# EAGLE design untitled (EAGLE 7.7.0)
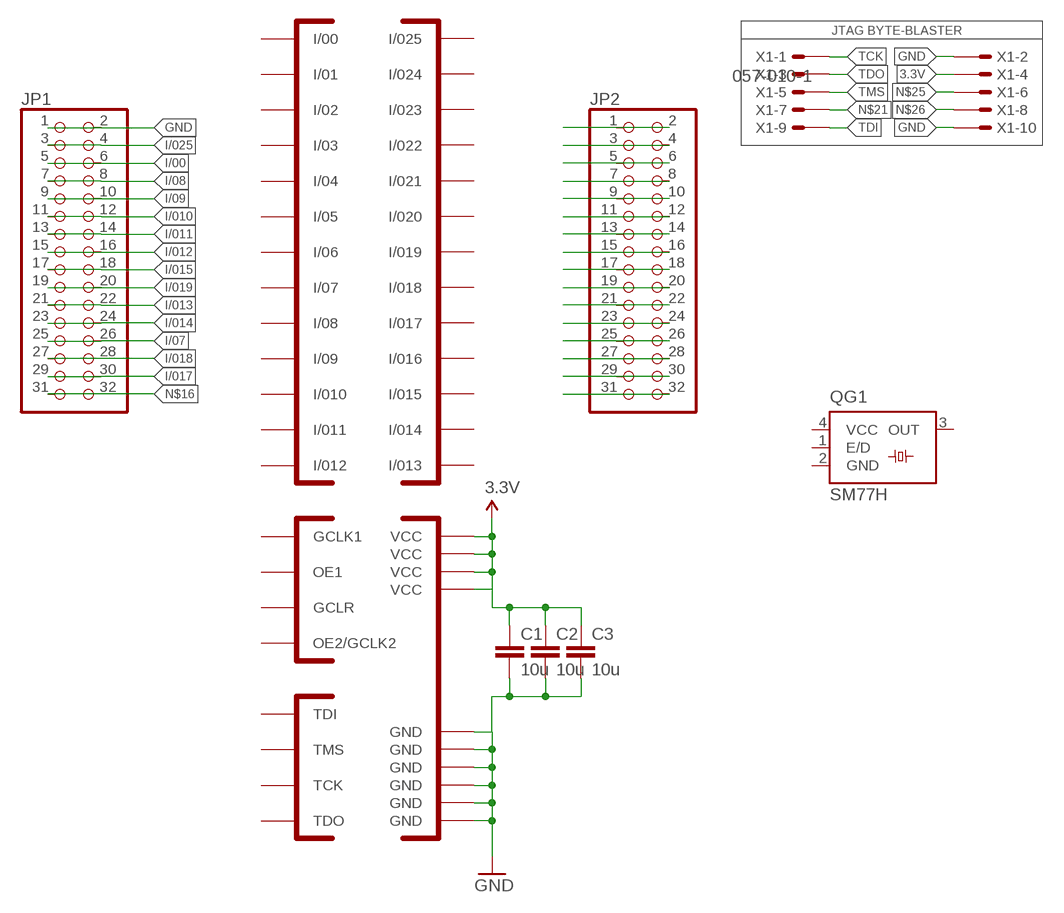
[diagram p0: schematic, sheet 1]

## Parts
C1  10u  CAP0805  [0805]
C2  10u  CAP0805  [0805]
C3  10u  CAP0805  [0805]
JP1  PINHD-2X16_2.54-SMD  [2X16SMD]
JP2  PINHD-2X16_2.54-SMD  [2X16SMD]
QG1  SM77H  [SM77H]
U$1  EPM3032  [TQFP44]
X1  057-010-1  [057-010-1]

## Nets
3.3V: C1.1 C2.1 C3.1 U$1.9(VCC) U$1.17(VCC) U$1.29(VCC) U$1.41(VCC) X1.4
GND: C1.2 C2.2 C3.2 JP1.1 JP1.2 U$1.4(GND) U$1.11(GND) U$1.16(GND) U$1.24(GND) U$1.30(GND) U$1.36(GND) X1.2 X1.10
I/00: JP1.5 JP1.6
I/07: JP1.25 JP1.26
I/08: JP1.7 JP1.8
I/09: JP1.9 JP1.10
I/010: JP1.11 JP1.12
I/011: JP1.13 JP1.14
I/012: JP1.15 JP1.16
I/013: JP1.21 JP1.22
I/014: JP1.23 JP1.24
I/015: JP1.17 JP1.18
I/017: JP1.29 JP1.30
I/018: JP1.27 JP1.28
I/019: JP1.19 JP1.20
I/025: JP1.3 JP1.4
N$1: JP2.7 JP2.8
N$2: JP2.27 JP2.28
N$3: JP2.31 JP2.32
N$4: JP2.23 JP2.24
N$5: JP2.19 JP2.20
N$6: JP2.15 JP2.16
N$7: JP2.1 JP2.2
N$8: JP2.3 JP2.4
N$9: JP2.11 JP2.12
N$10: JP2.5 JP2.6
N$11: JP2.9 JP2.10
N$12: JP2.13 JP2.14
N$13: JP2.17 JP2.18
N$14: JP2.21 JP2.22
N$15: JP2.25 JP2.26
N$16: JP1.31 JP1.32
N$17: JP2.29 JP2.30
N$21: X1.7
N$25: X1.6
N$26: X1.8
TCK: X1.1
TDI: X1.9
TDO: X1.3
TMS: X1.5
Unconnected: QG1.1(E/D) QG1.3(OUT)

## Notes on the sheet
- JTAG BYTE-BLASTER

## Power pins joined to a net without a drawn wire
GCLK1: U$1.37(GCLK1)
GCLR: U$1.39(GCLR)
GND: QG1.2(GND)
I/00: U$1.2(I/00)
I/01: U$1.5(I/01)
I/02: U$1.6(I/02)
I/03: U$1.12(I/03)
I/04: U$1.13(I/04)
I/05: U$1.14(I/05)
I/06: U$1.15(I/06)
I/07: U$1.25(I/07)
I/08: U$1.44(I/08)
I/09: U$1.43(I/09)
I/010: U$1.42(I/010)
I/011: U$1.35(I/011)
I/012: U$1.34(I/012)
I/013: U$1.28(I/013)
I/014: U$1.27(I/014)
I/015: U$1.33(I/015)
I/016: U$1.21(I/016)
I/017: U$1.22(I/017)
I/018: U$1.23(I/018)
I/019: U$1.31(I/019)
I/020: U$1.18(I/020)
I/021: U$1.19(I/021)
I/022: U$1.8(I/022)
I/023: U$1.20(I/023)
I/024: U$1.10(I/024)
I/025: U$1.3(I/025)
OE1: U$1.38(OE1)
OE2/GCLK2: U$1.40(OE2/GCLK2)
TCK: U$1.26(TCK)
TDI: U$1.1(TDI)
TDO: U$1.32(TDO)
TMS: U$1.7(TMS)
VCC: QG1.4(VCC)

## Library data of the parts
C1-C3 = SparkFun-Passives:CAP: Capacitor Standard 0603 ceramic capacitor, and 0.1" leaded capacitor.
JP1 JP2 = pinhead-2:PINHD-2X16: PIN HEADER
QG1 = crystal:SM77H: 3.3V CMOS Clock Oscillator Source: www.pletronics.com .. sm77h%203.3v.pdf; OC_FARNELL: unknown; OC_NEWARK: unknown
U$1 = EPM3032:EPM3032
X1 = con-panduit:057-010-: CONNECTOR 10-pin series 057 contact pc board low profile headers; OC_FARNELL: unknown; OC_NEWARK: unknown

## Board
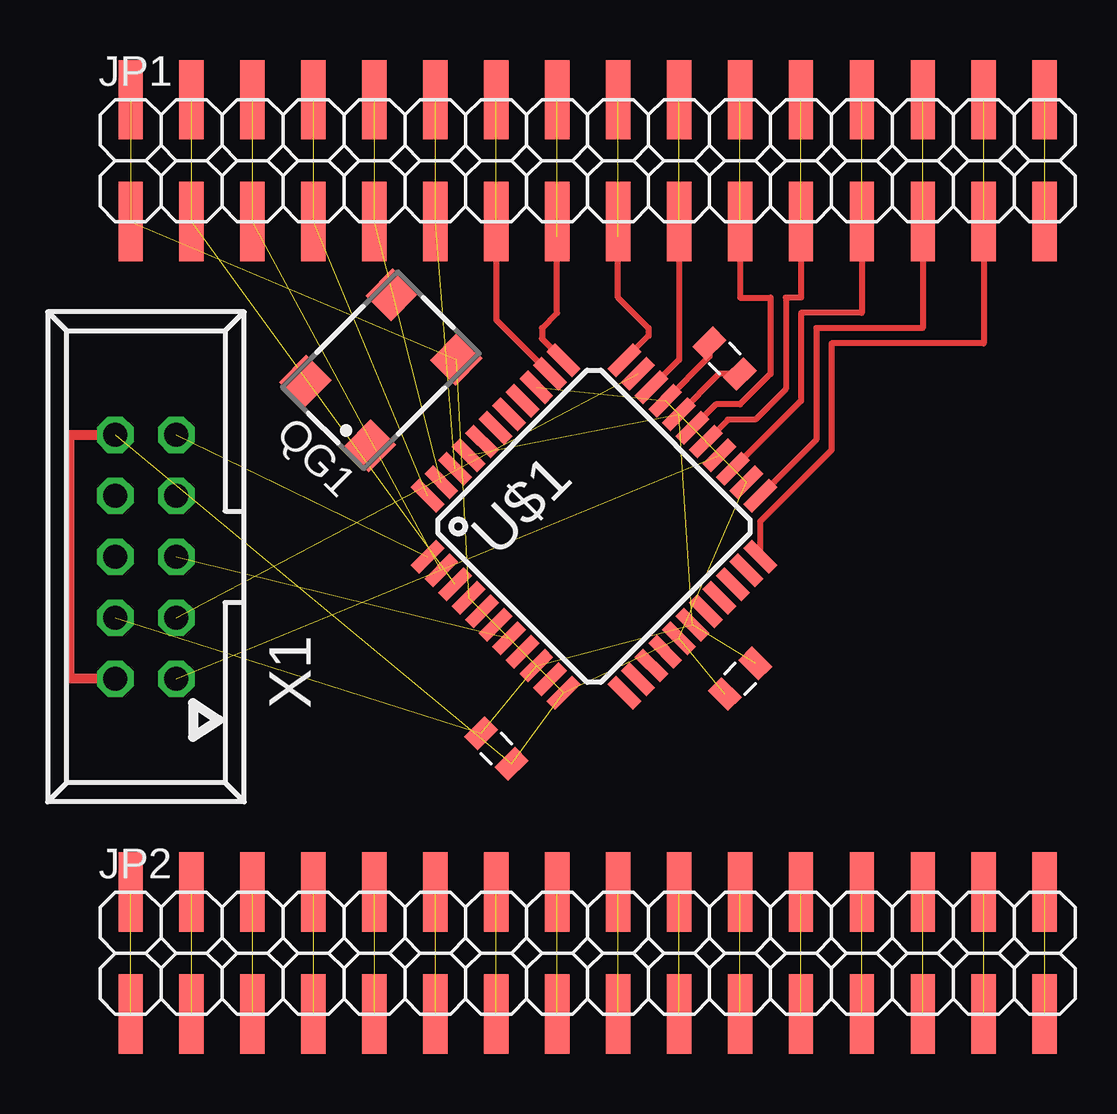
[diagram p1: board, top side]

No outline drawn. Coordinates in mm, seen from the top.
Copper layers (1*16): Top 0.035mm / dielectric 1.5mm / Bottom 0.035mm
Design rules "default": minimum track width 10mil, minimum drill 24mil, track to track 8mil, track to pad 8mil, pad to pad 8mil, via to via 8mil, smd to smd 8mil, copper to edge 40mil, drill to drill 8mil, minimum pad ring 10mil, minimum via ring 8mil, stop-mask expansion 4mil, vias tented up to drill 0mil, thermal gap 10mil

### Footprints (pad centres in the part's own frame; a part is rotated, then mirrored left to right if it is on the bottom)
0805 = smd 0.8 x 1.2: 1 -0.9,0; 2 0.9,0
2X16SMD = smd 1.016 x 3.302: 1 -1.27,-3.81; 2 -1.27,1.27; 3 1.27,-3.81; 4 1.27,1.27; 5 3.81,-3.81; 6 3.81,1.27; 7 6.35,-3.81; 8 6.35,1.27; 9 8.89,-3.81; 10 8.89,1.27; 11 11.43,-3.81; 12 11.43,1.27; 13 13.97,-3.81; 14 13.97,1.27; 15 16.51,-3.81; 16 16.51,1.27; 17 19.05,-3.81; 18 19.05,1.27; 19 21.59,-3.81; 20 21.59,1.27; 21 24.13,-3.81; 22 24.13,1.27; 23 26.67,-3.81; 24 26.67,1.27; 25 29.21,-3.81; 26 29.21,1.27; 27 31.75,-3.81; 28 31.75,1.27; 29 34.29,-3.81; 30 34.29,1.27; 31 36.83,-3.81; 32 36.83,1.27
SM77H = smd 1.6 x 1.5: 1 -2.55,-1.9; 2 2.55,-1.9; 3 2.55,1.9; 4 -2.55,1.9
TQFP44 = smd 1.5 x 0.5: 1 -5.8,4; 2 -5.8,3.2; 3 -5.8,2.4; 4 -5.8,1.6; 5 -5.8,0.8; 6 -5.8,0; 7 -5.8,-0.8; 8 -5.8,-1.6; 9 -5.8,-2.4; 10 -5.8,-3.2; 11 -5.8,-4; 23 5.8,-4; 24 5.8,-3.2; 25 5.8,-2.4; 26 5.8,-1.6; 27 5.8,-0.8; 28 5.8,0; 29 5.8,0.8; 30 5.8,1.6; 31 5.8,2.4; 32 5.8,3.2; 33 5.8,4 | smd 0.5 x 1.5: 12 -4,-5.8; 13 -3.2,-5.8; 14 -2.4,-5.8; 15 -1.6,-5.8; 16 -0.8,-5.8; 17 0,-5.8; 18 0.8,-5.8; 19 1.6,-5.8; 20 2.4,-5.8; 21 3.2,-5.8; 22 4,-5.8; 34 4,5.8; 35 3.2,5.8; 36 2.4,5.8; 37 1.6,5.8; 38 0.8,5.8; 39 0,5.8; 40 -0.8,5.8; 41 -1.6,5.8; 42 -2.4,5.8; 43 -3.2,5.8; 44 -4,5.8
057-010-1 = drill 1 octagon: 1 -5.08,-1.27; 2 -5.08,1.27; 3 -2.54,-1.27; 4 -2.54,1.27; 5 0,-1.27; 6 0,1.27; 7 2.54,-1.27; 8 2.54,1.27; 9 5.08,-1.27; 10 5.08,1.27

### Placement (x,y rotation side)
C1  21.59,21.85 315 top
C2  31.75,24.77 225 top
C3  31.11,38.1 135 top
JP1  7.62,47.62 0 top
JP2  7.62,14.61 0 top
QG1  16.77,37.62 45 top
U$1  25.66,31.11 45 top
X1  6.99,29.84 90 top

### Tracks (layer width: path | path; a pad name or v marks a point on that pad's centre or on a via)
3.3V  (6 unrouted)
  Top 0.254: C3.1 30.88,37.46 U$1.29
GND  (11 unrouted)
  Top 0.254: C3.2 30.48,38.19 U$1.30
  Top 0.406: X1.2 3.81,24.77 3.81,34.92 X1.10
I/00  (2 unrouted)
I/07  (1 unrouted)
  Top 0.254: JP1.25 36.83,40.01 34.29,40.01 34.29,36.35 U$1.25
I/08  (2 unrouted)
I/09  (2 unrouted)
I/010  (2 unrouted)
I/011  (1 unrouted)
  Top 0.254: JP1.13 21.59,39.71 U$1.35
I/012  (2 unrouted)
  Top 0.254: U$1.34 23.5,38.94 23.5,39.37 24.13,40.01 24.13,43.18
I/013  (1 unrouted)
  Top 0.254: JP1.21 31.75,40.64 33.02,40.64 33.02,37.47 31.75,36.2 30.74,36.2 U$1.28
I/014  (1 unrouted)
  Top 0.254: JP1.23 34.29,40.64 33.66,40.64 33.66,36.83 32.38,35.56 31.24,35.56 U$1.27
I/015  (2 unrouted)
  Top 0.254: U$1.33 27.94,39.05 27.94,39.37 26.67,40.64 26.67,43.18
I/017  (1 unrouted)
  Top 0.254: U$1.22 32.59,31.32 35.56,34.29 35.56,38.73 41.91,38.73 JP1.29
I/018  (1 unrouted)
  Top 0.254: JP1.27 39.37,39.37 34.92,39.37 34.92,34.72 U$1.23
I/019  (1 unrouted)
  Top 0.254: JP1.19 29.21,38.06 U$1.31
I/025  (2 unrouted)
N$1  (1 unrouted)
N$2  (1 unrouted)
N$3  (1 unrouted)
N$4  (1 unrouted)
N$5  (1 unrouted)
N$6  (1 unrouted)
N$7  (1 unrouted)
N$8  (1 unrouted)
N$9  (1 unrouted)
N$10  (1 unrouted)
N$11  (1 unrouted)
N$12  (1 unrouted)
N$13  (1 unrouted)
N$14  (1 unrouted)
N$15  (1 unrouted)
N$16  (1 unrouted)
N$17  (1 unrouted)
TCK  (1 unrouted)
TDI  (1 unrouted)
TDO  (1 unrouted)
TMS  (1 unrouted)